# Altium schematic sheet PIC.Schematic.SchDoc
size A
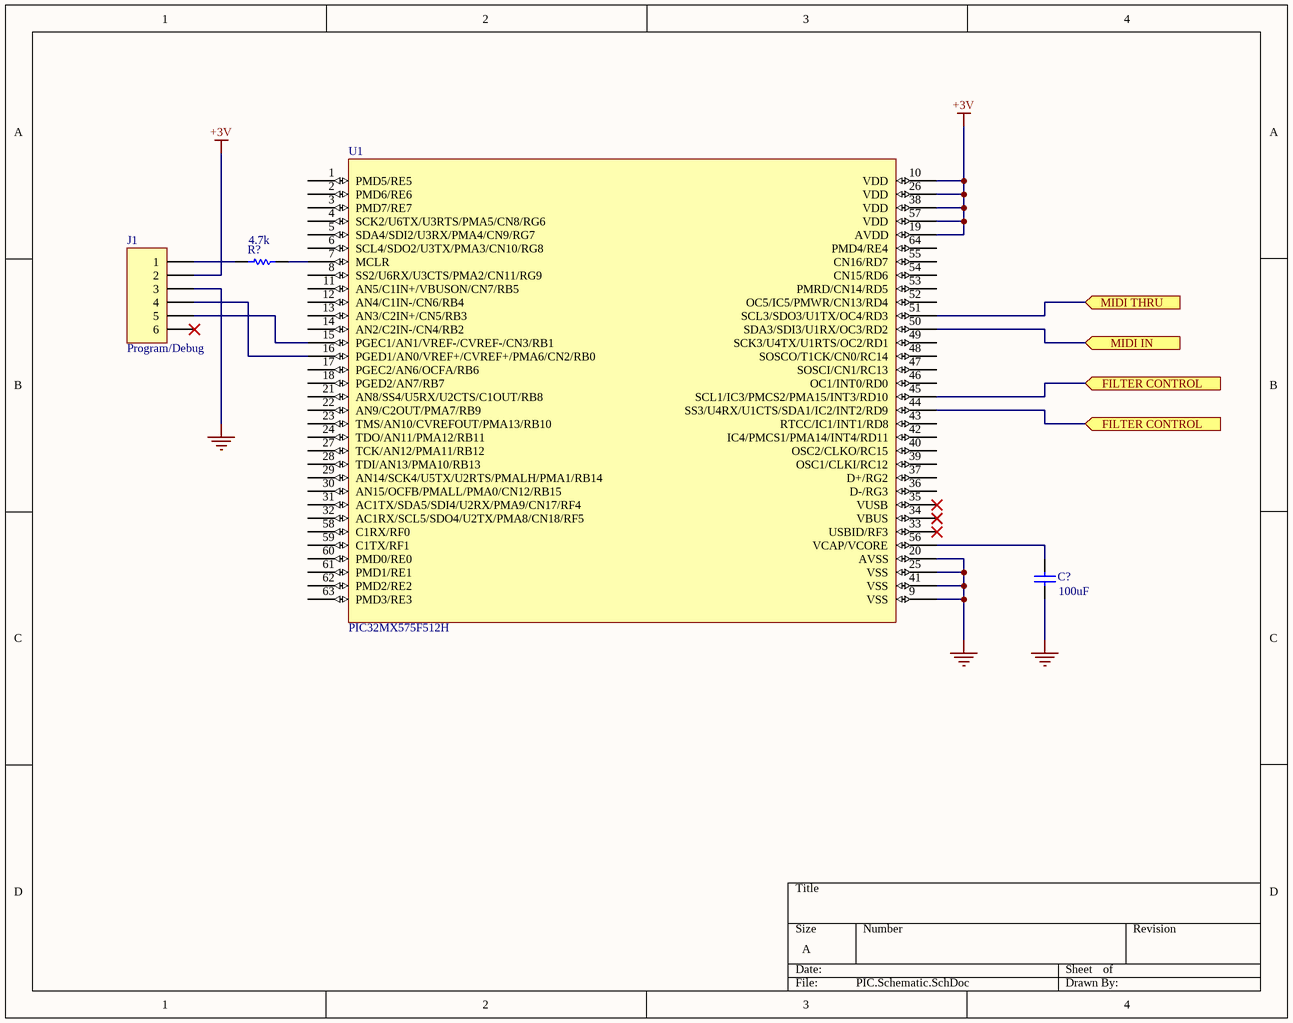
[diagram p0: PIC.Schematic.SchDoc]

## Parts
C?  value 100uF  [RAD-0.3]  (hidden comment: Cap)
J1  Program/Debug  [HDR1X6H]
R?  value 4.7k  [AXIAL-0.3]  (hidden comment: Res1)
U1  PIC32MX575F512H

## Ports
FILTER CONTROL (in), MIDI IN (in), MIDI THRU (in)

## Nets
+3V: J1.2 U1.10(VDD) U1.19(AVDD) U1.26(VDD) U1.38(VDD) U1.57(VDD)
GND: C?.1 J1.3 U1.9(VSS) U1.20(AVSS) U1.25(VSS) U1.41(VSS)
FILTER CONTROL: U1.44(SS3/U4RX/U1CTS/SDA1/IC2/INT2/RD9) U1.45(SCL1/IC3/PMCS2/PMA15/INT3/RD10) ; port FILTER CONTROL
MIDI IN: U1.50(SDA3/SDI3/U1RX/OC3/RD2) ; port MIDI IN
MIDI THRU: U1.51(SCL3/SDO3/U1TX/OC4/RD3) ; port MIDI THRU
NetC?_2: C?.2 U1.56(VCAP/VCORE)
NetJ1_1: J1.1 R?.1
NetJ1_4: J1.4 U1.16(PGED1/AN0/VREF+/CVREF+/PMA6/CN2/RB0)
NetJ1_5: J1.5 U1.15(PGEC1/AN1/VREF-/CVREF-/CN3/RB1)
NetR?_2: R?.2 U1.7(MCLR)

Not connected (* = marked no-connect by the designer): J1 6*; U1 1(PMD5/RE5) 2(PMD6/RE6) 3(PMD7/RE7) 4(SCK2/U6TX/U3RTS/PMA5/CN8/RG6) 5(SDA4/SDI2/U3RX/PMA4/CN9/RG7) 6(SCL4/SDO2/U3TX/PMA3/CN10/RG8) 8(SS2/U6RX/U3CTS/PMA2/CN11/RG9) 11(AN5/C1IN+/VBUSON/CN7/RB5) 12(AN4/C1IN-/CN6/RB4) 13(AN3/C2IN+/CN5/RB3) 14(AN2/C2IN-/CN4/RB2) 17(PGEC2/AN6/OCFA/RB6) 18(PGED2/AN7/RB7) 21(AN8/SS4/U5RX/U2CTS/C1OUT/RB8) 22(AN9/C2OUT/PMA7/RB9) 23(TMS/AN10/CVREFOUT/PMA13/RB10) 24(TDO/AN11/PMA12/RB11) 27(TCK/AN12/PMA11/RB12) 28(TDI/AN13/PMA10/RB13) 29(AN14/SCK4/U5TX/U2RTS/PMALH/PMA1/RB14) 30(AN15/OCFB/PMALL/PMA0/CN12/RB15) 31(AC1TX/SDA5/SDI4/U2RX/PMA9/CN17/RF4) 32(AC1RX/SCL5/SDO4/U2TX/PMA8/CN18/RF5) 33(USBID/RF3)* 34(VBUS)* 35(VUSB)* 36(D-/RG3) 37(D+/RG2) 39(OSC1/CLKI/RC12) 40(OSC2/CLKO/RC15) 42(IC4/PMCS1/PMA14/INT4/RD11) 43(RTCC/IC1/INT1/RD8) 46(OC1/INT0/RD0) 47(SOSCI/CN1/RC13) 48(SOSCO/T1CK/CN0/RC14) 49(SCK3/U4TX/U1RTS/OC2/RD1) 52(OC5/IC5/PMWR/CN13/RD4) 53(PMRD/CN14/RD5) 54(CN15/RD6) 55(CN16/RD7) 58(C1RX/RF0) 59(C1TX/RF1) 60(PMD0/RE0) 61(PMD1/RE1) 62(PMD2/RE2) 63(PMD3/RE3) 64(PMD4/RE4)

## Library data of the parts
C? = Cap: Capacitor; Published: 8-Jun-2000; LatestRevisionDate: 17-Jul-2002; LatestRevisionNote: Re-released for DXP Platform.; PackageReference: RAD-0.3; Publisher: Altium Limited; PackageDescription: Radial Cap, Thru-Hole; 2 Leads; 0.3 in Pin Spacing
J1 = Header 6H: Header, 6-Pin, Right Angle; LatestRevisionDate: 17-Jul-2002; LatestRevisionNote: Re-released for DXP Platform.; Publisher: Altium Limited
R? = Res1: Resistor; Published: 8-Jun-2000; LatestRevisionDate: 17-Jul-2002; LatestRevisionNote: Re-released for DXP Platform.; PackageReference: AXIAL-0.3; Publisher: Altium Limited; PackageDescription: Axial Device, Thru-Hole; 2 Leads; 0.3 in Pin Spacing